# Altium schematic sheet Power.SchDoc
size 420 x 297 mm
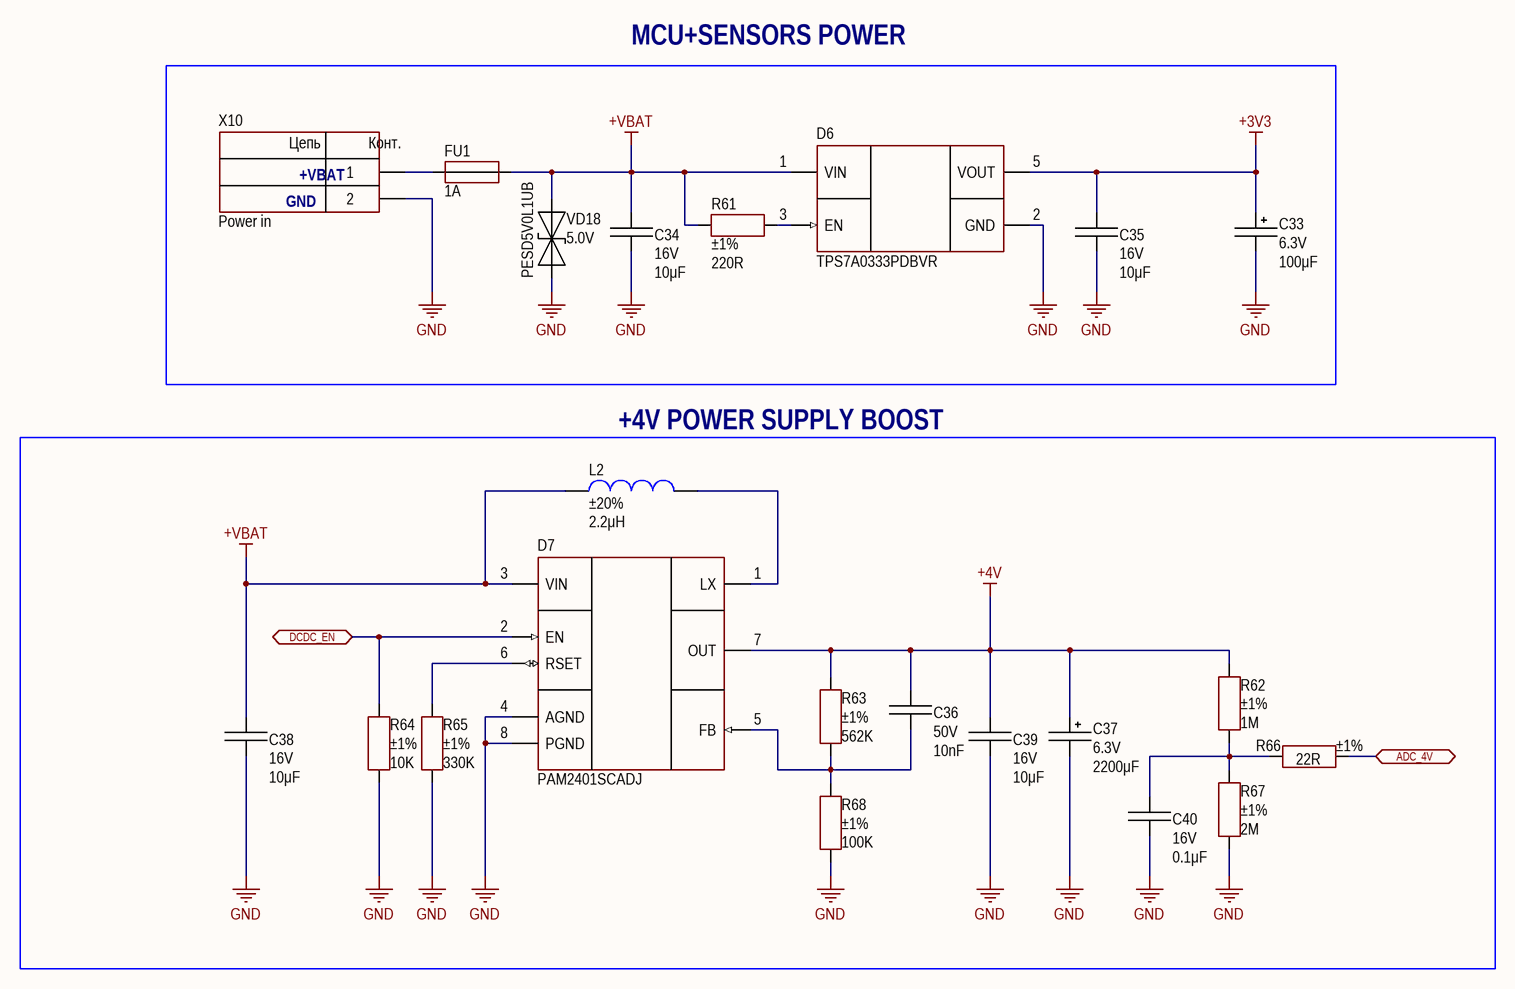
[diagram p0: Power.SchDoc]

## Parts
C33  value 100μF  Voltage: 6.3V  [CAP: TANTAL-A]
C34  value 10μF  Voltage: 16V  [CAP: 0805]
C35  value 10μF  Voltage: 16V  [CAP: 0805]
C36  value 10nF  Voltage: 50V  [CAP: 0402]
C37  value 2200μF  Voltage: 6.3V  [CAP: D10C5H12.5]
C38  value 10μF  Voltage: 16V  [CAP: 0805]
C39  value 10μF  Voltage: 16V  [CAP: 0805]
C40  value 0.1μF  Voltage: 16V  [CAP: 0402]
D6  PartNumber: TPS7A0333PDBVR  [SOT23-5]
D7  (no value)  [8-TSSOP]
FU1  MaxCurrent: 1A  [FUSE: 1206]
L2  value 2.2μH  Tolerance: ±20%  [IND: 1008 (2520)]
R61  value 220R  Tolerance: ±1%  [RES: 0402]
R62  value 1M  Tolerance: ±1%  [RES: 0402]
R63  value 562K  Tolerance: ±1%  [RES: 0402]
R64  value 10K  Tolerance: ±1%  [RES: 0402]
R65  value 330K  Tolerance: ±1%  [RES: 0402]
R66  value 22R  Tolerance: ±1%  [RES: 0402]
R67  value 2M  Tolerance: ±1%  [RES: 0402]
R68  value 100K  Tolerance: ±1%  [RES: 0402]
VD18  Voltage: 5.0V  PartNumber: PESD5V0L1UB  [DIODE: SOD523]
X10  CommentText: Power in  [CON: 282834-2]

## Blocks framed on the sheet
MCU+SENSORS POWER: C33-C35 D6 FU1 R61 VD18 X10
+4V POWER SUPPLY BOOST: C36-C40 D7 L2 R62-R68

## Ports
ADC_4V (bidir), DCDC_EN (bidir)

## Nets
+3V3: C33.1 C35.2 D6.5(VOUT)
+4V: C36.2 C37.1 C39.2 D7.7(OUT) R62.2 R63.2
+VBAT: C34.2 C38.2 D6.1(VIN) D7.3(VIN) FU1.2 L2.2 R61.2 VD18.2(C)
GND: C33.2 C34.1 C35.1 C37.2 C38.1 C39.1 C40.1 D6.2(GND) D7.4(AGND) D7.8(PGND) R64.1 R65.1 R67.1 R68.1 VD18.1(A) X10.2
ADC_4V: R66.2 ; port ADC_4V
DCDC_EN: D7.2(EN) R64.2 ; port DCDC_EN
NetC36_1: C36.1 D7.5(FB) R63.1 R68.2
NetC40_2: C40.2 R62.1 R66.1 R67.2
NetD6_3: D6.3(EN) R61.1
NetD7_1: D7.1(LX) L2.1
NetD7_6: D7.6(RSET) R65.2
NetFU1_1: FU1.1 X10.1

## Notes on the sheet
- GND
- +VBAT
- Author
- Manufacturer
- Date
- Page
- Total pages
- Size page
- A3
- Materials
- (in symbol KLS2-308V-2.54-02P-4S) Цепь; Конт.

## Library data of the parts
C33 = Tantal_A: 100 µF Molded Tantalum Polymer Capacitor 6.3 V 1206 (3216 Metric) 100mOhm @ 100kHz; Manufacturer: AVX; PartNumber: TCJA107M006R0100; ValueManufacturerPartNumber: Tantalum capacitor, 100μF, 6.3V, ±10%, 0.1Ohm, case A (3216), -55...+125°C; Impedance: 0.1Ohm; Tolerance: ±10%; TypeCapacitor: Tantalum capacitor; Package: case A (3216); HelpURL: https://www.digikey.com/en/products/detail/avx-corporation/TCJA107M006R0100/4990371; Temperature: -55...+125°C; TypeDielectric: Polymer
C34 C35 C38 C39 = Ceramic_0805: ±20% 16V Ceramic Capacitor X7R 0805 (2012 Metric); Manufacturer: Yageo; PartNumber: CC0805MKX7R7BB106; ValueManufacturerPartNumber: Ceramic capacitor, 10μF, X7R, ±10%, 16V, 0805, -55...+125°C; Tolerance: ±10%; Package: 0805; HelpURL: https://www.digikey.com/en/products/detail/yageo/CC0805MKX7R7BB106/7164392; Temperature: -55...+125°C; TypeCapacitor: Ceramic capacitor; TypeDielectric: X7R
C36 = Ceramic_0402: 10000 pF ±10% 50V Ceramic Capacitor X7R 0402 (1005 Metric); Manufacturer: Yageo; PartNumber: CC0402KRX7R9BB103; ValueManufacturerPartNumber: Ceramic capacitor, 10nF, X7R, ±10%, 50V, 0402, -55...+125°C; Package: 0402; HelpURL: https://www.digikey.com/en/products/detail/yageo/CC0402KRX7R9BB103/2103087; Temperature: -55...+125°C; TypeCapacitor: Ceramic capacitor; Tolerance: ±10%; TypeDielectric: X7R
C37 = Aluminium: 2200 µF 6.3 V Aluminum - Polymer Capacitors Radial, Can 13mOhm 2000 Hrs @ 125°C; Manufacturer: KEMET; PartNumber: A759MS228M0JAAE013; ValueManufacturerPartNumber: Aluminium capacitor, 2200μF, 6.3V, ±20%, 13mOhm, 10x12x5 mm, -55...+105°C; TypeCapacitor: Aluminium capacitor; Tolerance: ±20%; Package: 10x12x5 mm; HelpURL: https://www.digikey.com/en/products/detail/kemet/A759MS228M0JAAE013/13420067; Temperature: -55...+105°C; Impedance: 13mOhm
C40 = Ceramic_0402: ±10% 16V Ceramic Capacitor X7R 0402 (1005 Metric); Manufacturer: Yageo; PartNumber: CC0402KRX7R7BB104; ValueManufacturerPartNumber: Ceramic capacitor, 0.1μF, X7R, ±10%, 16V, 0402, -55...+125°C; Package: 0402; HelpURL: https://www.digikey.com/product-detail/en/yageo/CC0402KRX7R7BB104/311-1338-1-ND/2103122; Temperature: -55...+125°C; TypeCapacitor: Ceramic capacitor; Tolerance: ±10%; TypeDielectric: X7R
D6 = AP2204K-3.3TRG1: Linear Voltage Regulator IC Positive Fixed 1 Output 3.3V 200mA SOT-23-5; Manufacturer: Texas Instruments; ValueManufacturerPartNumber: Linear voltage regulator, input 3.2...6V, 0.27V, output 3.3V, 0.2A, -40...+85°C, SOT23-6; VoltageInput: input 3.2...6V; MaxDropout: 0.27V; CurrentOutput: 0.2A; HelpURL: https://www.digikey.com/en/products/detail/texas-instruments/TPS7A0333PDBVR/12165108; Package: SOT23-6; ComponentType: Linear voltage regulator; Temperature: -40...+85°C; VoltageOutput: output 3.3V
D7 = PAM2401SCADJ: Boost Switching Regulator IC Positive Adjustable 2.5V 1 Output 1A 8-TSSOP, 8-MSOP (0.118", 3.00mm Width); Manufacturer: Diodes Incorporated; ValueManufacturerPartNumber: DC/DC boost converter, input 0.9...4.75V, 1MHz, output 2.5..5V, 1A, -40...+125°C, TO-263-5; VoltageInput: input 0.9...4.75V; Frequency: 1MHz; VoltageOutput: output 2.5..5V; HelpURL: https://www.digikey.com/en/products/detail/diodes-incorporated/PAM2401SCADJ/4898817; Package: TO-263-5; ComponentType: DC/DC boost converter; Temperature: -40...+125°C; CurrentOutput: 1A; Parameter 1: DC/DC boost converter, input 0.9...4.75V, 1MHz, output 2.5..5V, 1A, -40...+125°C, TO-263-5; PartNumber: PAM2401SCADJ
FU1 = Fuse: Polymeric PTC Resettable Fuse 6V 1 A Ih Surface Mount 1206 (3216 Metric), Concave; Manufacturer: Bel Fuse Inc.; PartNumber: 0ZCJ0100FF2E; TypeFuse: Electromechanics relay; Package: 1206; HelpURL: https://www.digikey.com/en/products/detail/bel-fuse-inc/0ZCJ0100FF2E/4156136; ValueManufacturerPartNumber: =TypeFuse+', '+VoltageMax+', '+MaxCurrent+', '+Package+', '+Temperature; VoltageMax: 6V
L2 = Inductor_1008 (2520): 2.2 µH Shielded Multilayer Inductor 1.3 A 80mOhm Max 1008 (2520 Metric); Manufacturer: Bourns; PartNumber: CVH252009-2R2M; ValueManufacturerPartNumber: Fixed inductor, 2.2μH, ±20%, 1008, 1.3A, -40...+150°C; TypeInductor: Fixed inductor; MaxCurrent: 1.3A; Package: 1008; HelpURL: https://www.digikey.com/en/products/detail/bourns-inc/CVH252009-2R2M/3440072; Temperature: -40...+150°C
R61 = Resistor_0402: 220 Ohms ±1% 0.063W, 1/16W Chip Resistor 0402 (1005 Metric) Moisture Resistant Thick Film; Manufacturer: Yageo; PartNumber: RC0402FR-07220RL; ValueManufacturerPartNumber: Resistor film, 220R, ±1%, 0402, 0.063W, -55...+125°C; TypeResistor: Resistor film; Package: 0402; HelpURL: https://www.digikey.com/en/products/detail/yageo/RC0402FR-07220RL/726565; Temperature: -55...+125°C; Power: 0.063W
R62 = Resistor_0402: 1 MOhms ±1% 0.063W, 1/16W Chip Resistor 0402 (1005 Metric) Moisture Resistant Thick Film; Manufacturer: Yageo; PartNumber: RC0402FR-071ML; ValueManufacturerPartNumber: Resistor film, 1M, ±1%, 0402, 0.063W, -55...+125°C; TypeResistor: Resistor film; Package: 0402; HelpURL: https://www.digikey.com/en/products/detail/yageo/RC0402FR-071ML/726515; Temperature: -55...+125°C; Power: 0.063W
R63 = Resistor_0402: 562 kOhms ±1% 0.063W, 1/16W Chip Resistor 0402 (1005 Metric) Moisture Resistant Thick Film; Manufacturer: Yageo; PartNumber: RC0402FR-07562KL; ValueManufacturerPartNumber: Resistor film, 562K, ±1%, 0402, 0.063W, -55...+125°C; TypeResistor: Resistor film; Package: 0402; HelpURL: https://www.digikey.com/en/products/detail/yageo/RC0402FR-07562KL/726639; Temperature: -55...+125°C; Power: 0.063W
R64 = Resistor_0402: 10 kOhms ±1% 0.063W, 1/16W Chip Resistor 0402 (1005 Metric) Moisture Resistant Thick Film; Manufacturer: Yageo; PartNumber: RC0402FR-0710KL; ValueManufacturerPartNumber: Resistor film, 10K, ±1%, 0402, 0.063W, -55...+125°C; TypeResistor: Resistor film; Package: 0402; HelpURL: https://www.digikey.com/en/products/detail/yageo/RC0402FR-0710KL/726523; Temperature: -55...+125°C; Power: 0.063W
R65 = Resistor_0402: 330 kOhms ±1% 0.063W, 1/16W Chip Resistor 0402 (1005 Metric) Moisture Resistant Thick Film; Manufacturer: Yageo; PartNumber: RC0402FR-07330KL; ValueManufacturerPartNumber: Resistor film, 330K, ±1%, 0402, 0.063W, -55...+125°C; TypeResistor: Resistor film; Package: 0402; HelpURL: https://www.digikey.com/en/products/detail/yageo/RC0402FR-07330KL/2827574; Temperature: -55...+125°C; Power: 0.063W
R66 = Resistor_0402: 22 Ohms ±1% 0.063W, 1/16W Chip Resistor 0402 (1005 Metric) Moisture Resistant Thick Film; Manufacturer: Yageo; PartNumber: RC0402FR-0722RL; ValueManufacturerPartNumber: Resistor film, 22R, ±1%, 0402, 0.063W, -55...+125°C; TypeResistor: Resistor film; Package: 0402; HelpURL: https://www.digikey.com/en/products/detail/yageo/RC0402FR-0722RL/726562; Temperature: -55...+125°C; Power: 0.063W
R67 = Resistor_0402: 2 MOhms ±1% 0.063W, 1/16W Chip Resistor 0402 (1005 Metric) Moisture Resistant Thick Film; Manufacturer: Yageo; PartNumber: RC0402FR-072ML; ValueManufacturerPartNumber: Resistor film, 2M, ±1%, 0402, 0.063W, -55...+125°C; TypeResistor: Resistor film; Package: 0402; HelpURL: https://www.digikey.com/en/products/detail/yageo/RC0402FR-072ML/5917635; Temperature: -55...+125°C; Power: 0.063W
R68 = Resistor_0402: 100 kOhms ±1% 0.063W, 1/16W Chip Resistor 0402 (1005 Metric) Moisture Resistant Thick Film; Manufacturer: Yageo; PartNumber: RC0402FR-07100KL; ValueManufacturerPartNumber: Resistor film, 100K, ±1%, 0402, 0.063W, -55...+125°C; TypeResistor: Resistor film; Package: 0402; HelpURL: https://www.digikey.com/en/products/detail/yageo/RC0402FR-07100KL/726526; Temperature: -55...+125°C; Power: 0.063W
VD18 = TVS_single: 12V Clamp 3.5A (8/20µs) Ipp Tvs Diode Surface Mount SOD-523; Manufacturer: Nexperia; TypeDiode: ESD TVS diode; Package: SOD-523; HelpURL: https://www.digikey.com/en/products/detail/nexperia-usa-inc/PESD5V0L1UB115/2092297; ValueManufacturerPartNumber: =TypeDiode+', '+Voltage+', '+Current+', '+VoltageDrop+', '+RecoveryTime+', '+Package+', '+Temperature; Temperature: -55...+150°C; Current: 3.5A
X10 = KLS2-308V-2.54-02P-4S: 2 Position Wire to Board Terminal Block Horizontal with Board 0.100" (2.54mm) Through Hole; Manufacturer: KLS; TypeConnector: Block Terminal; VoltageMax: 500VAC; CurrentMax: 15A; Multichannel: 2pin; HelpURL: http://www.klsele.com/products/Terminal-blocks/560/278.html; ValueManufacturerPartNumber: =TypeConnector+', '+Multichannel+', '+Pitch+', '+VoltageMax+', '+CurrentMax; PartNumber: KLS2-308V-2.54-02P-4S